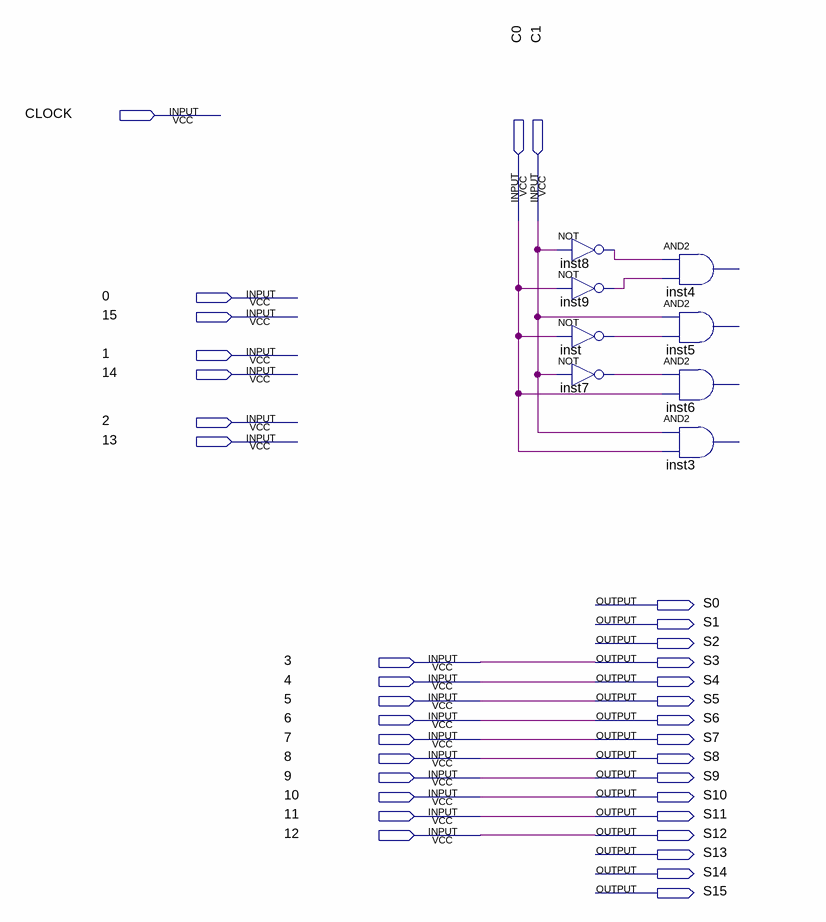
[diagram p0: schematic sheet]
// Quartus schematic overloading.bdf as structural Verilog: 8 symbols, 35 pins
module overloading (
  input  CLOCK,
  input  C0,
  input  C1,
  input  \0 ,
  input  \15 ,
  input  \1 ,
  input  \14 ,
  input  \2 ,
  input  \13 ,
  input  \3 ,
  input  \4 ,
  input  \5 ,
  input  \6 ,
  input  \7 ,
  input  \8 ,
  input  \9 ,
  input  \10 ,
  input  \11 ,
  input  \12 ,
  output S0,
  output S1,
  output S2,
  output S3,
  output S4,
  output S5,
  output S6,
  output S7,
  output S8,
  output S9,
  output S10,
  output S11,
  output S12,
  output S13,
  output S14,
  output S15
);

  wire inst7_out, inst8_out, inst9_out, inst_out;

  not inst8 (inst8_out, C1);
  not inst9 (inst9_out, C0);
  not inst (inst_out, C0);
  not inst7 (inst7_out, C1);
  // AND2 inst4 has open pins: IN1=inst8_out, IN2=inst9_out, OUT=open
  // AND2 inst5 has open pins: IN1=C1, IN2=inst_out, OUT=open
  // AND2 inst6 has open pins: IN1=inst7_out, IN2=C0, OUT=open
  // AND2 inst3 has open pins: IN1=C1, IN2=C0, OUT=open

  assign S3 = \3 ;
  assign S4 = \4 ;
  assign S5 = \5 ;
  assign S6 = \6 ;
  assign S7 = \7 ;
  assign S8 = \8 ;
  assign S9 = \9 ;
  assign S10 = \10 ;
  assign S11 = \11 ;
  assign S12 = \12 ;
endmodule
